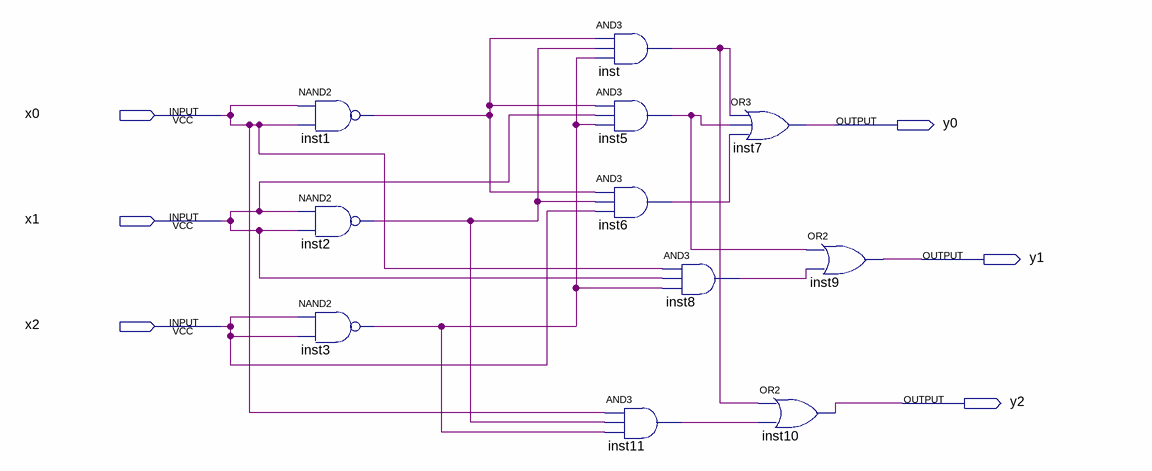
[diagram p0: schematic sheet]
// Quartus schematic SUB.bdf as structural Verilog: 11 symbols, 6 pins
module SUB (
  input  x0,
  input  x1,
  input  x2,
  output y0,
  output y1,
  output y2
);

  wire inst1_out, inst2_out, inst3_out, inst5_out, inst6_out, inst8_out, inst11_out, inst_out;

  nand inst1 (inst1_out, x0, x0);
  nand inst2 (inst2_out, x1, x1);
  nand inst3 (inst3_out, x2, x2);
  and inst (inst_out, inst1_out, inst2_out, inst3_out);
  and inst5 (inst5_out, inst1_out, x1, inst3_out);
  and inst6 (inst6_out, inst1_out, inst2_out, x2);
  and inst11 (inst11_out, x0, inst2_out, inst3_out);
  and inst8 (inst8_out, x0, x1, inst3_out);
  or inst7 (y0, inst_out, inst5_out, inst6_out);
  or inst10 (y2, inst_out, inst11_out);
  or inst9 (y1, inst5_out, inst8_out);
endmodule
